# Altium schematic sheet 12V_SIGNAL_BULKHEAD.SchDoc
size A4
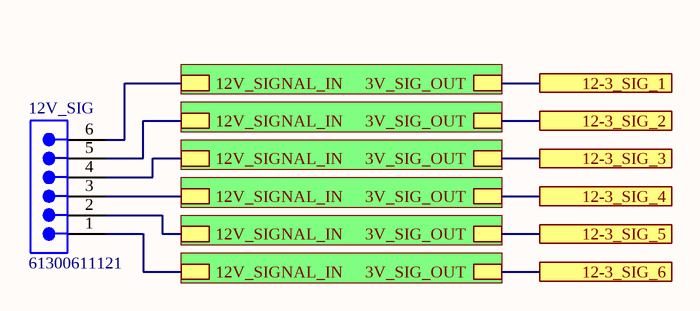
[diagram p0: 12V_SIGNAL_BULKHEAD.SchDoc]

## Parts
12V_SIG  61300611121  [61300611121]

## Sub-sheets
? = 12_TO_3V3_VOLTAGE_DIVIDER.SchDoc: 12V_SIGNAL_IN, 3V_SIG_OUT
? = 12_TO_3V3_VOLTAGE_DIVIDER.SchDoc: 12V_SIGNAL_IN, 3V_SIG_OUT
? = 12_TO_3V3_VOLTAGE_DIVIDER.SchDoc: 12V_SIGNAL_IN, 3V_SIG_OUT
? = 12_TO_3V3_VOLTAGE_DIVIDER.SchDoc: 12V_SIGNAL_IN, 3V_SIG_OUT
? = 12_TO_3V3_VOLTAGE_DIVIDER.SchDoc: 12V_SIGNAL_IN, 3V_SIG_OUT
? = 12_TO_3V3_VOLTAGE_DIVIDER.SchDoc: 12V_SIGNAL_IN, 3V_SIG_OUT

## Ports
12-3_SIG_1, 12-3_SIG_2, 12-3_SIG_3, 12-3_SIG_4, 12-3_SIG_5, 12-3_SIG_6

## Nets
12-3_SIG_1: port 12-3_SIG_1, sheet /3V_SIG_OUT
12-3_SIG_2: port 12-3_SIG_2, sheet /3V_SIG_OUT
12-3_SIG_3: port 12-3_SIG_3, sheet /3V_SIG_OUT
12-3_SIG_4: port 12-3_SIG_4, sheet /3V_SIG_OUT
12-3_SIG_5: port 12-3_SIG_5, sheet /3V_SIG_OUT
12-3_SIG_6: port 12-3_SIG_6, sheet /3V_SIG_OUT
Net12V_SIG_1: 12V_SIG.1 ; sheet /12V_SIGNAL_IN
Net12V_SIG_2: 12V_SIG.2 ; sheet /12V_SIGNAL_IN
Net12V_SIG_3: 12V_SIG.3 ; sheet /12V_SIGNAL_IN
Net12V_SIG_4: 12V_SIG.4 ; sheet /12V_SIGNAL_IN
Net12V_SIG_5: 12V_SIG.5 ; sheet /12V_SIGNAL_IN
Net12V_SIG_6: 12V_SIG.6 ; sheet /12V_SIGNAL_IN

## Library data of the parts
12V_SIG = CMP-1502-01070-2: NexarPartId: 20084590; Operating Supply Voltage: 250V; Current Rating: 3A; Number of Contacts: 6; Gender: Male; Connector Type: Male Pin; Pitch: 2.54mm; Contact Resistance: 20mΩ; Lead Free: Lead Free; REACH SVHC: Unknown; Number of Rows: 1; Color: Black; Min Operating Temperature: -40°C; Contact Material: Copper; Lead Pitch: 2.54mm; Contact Plating: Gold; Number of Pins: 6; Height: 8.89mm; Orientation: Vertical; Termination: Through Hole; Mount: Through Hole; RoHS: Compliant; Contact Gender: Male; Contact Mating Length: 5.9944mm; Voltage Rating: 250V; Number of Positions: 6; Housing Material: PBT; Packaging: Bulk; Max Operating Temperature: 105°C